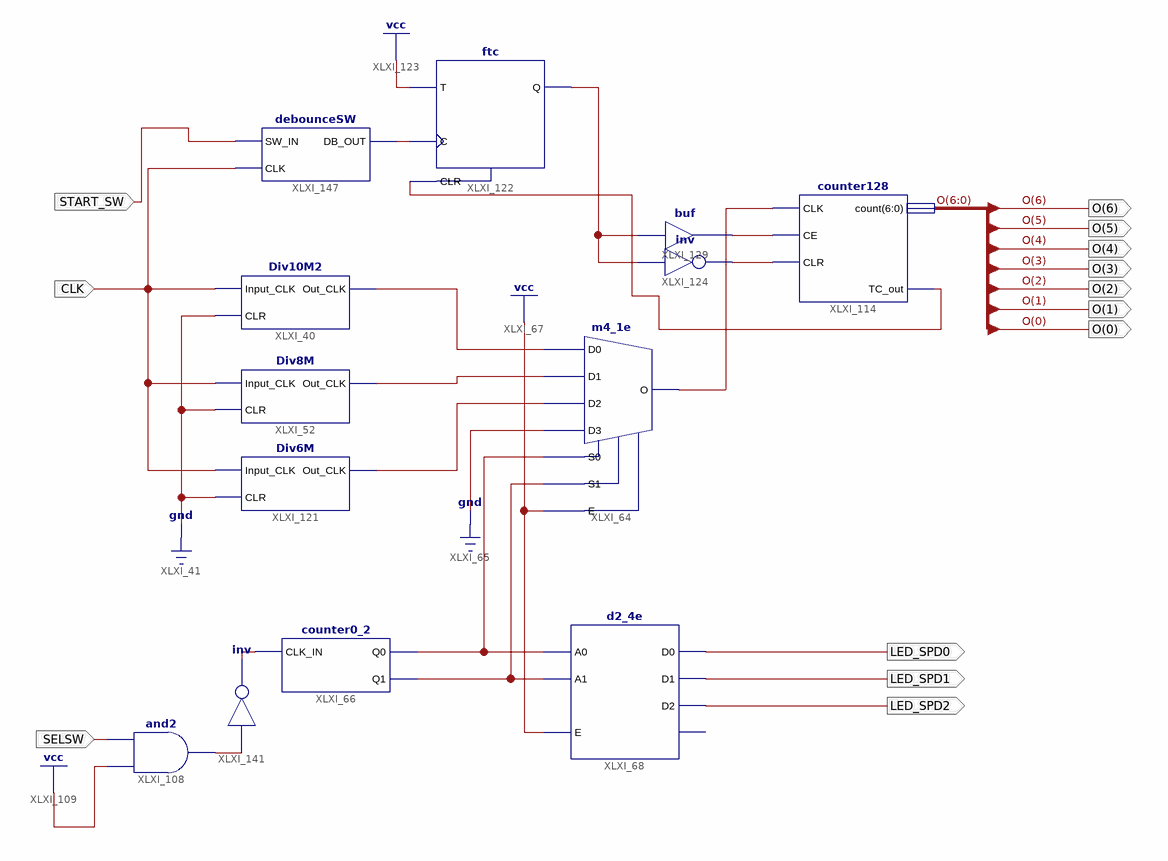
[diagram p0: schematic sheet 1]
// Xilinx ISE schematic project.sch (spartan6) as structural Verilog: 13 symbols, 13 ports
module project (
  input  CLK,
  input  SELSW,
  input  START_SW,
  output LED_SPD0,
  output LED_SPD1,
  output LED_SPD2,
  output [6:0] O
);

  wire XLXN_125, XLXN_126, XLXN_127, XLXN_129, XLXN_130, XLXN_184, XLXN_185, XLXN_188, XLXN_214, XLXN_215,
       XLXN_217, XLXN_235, XLXN_251;

  Div10M2 XLXI_40 (.Input_CLK(CLK), .CLR(1'b0), .Out_CLK(XLXN_125));
  m4_1e XLXI_64 (
    .D0(XLXN_125), .D1(XLXN_126), .D2(XLXN_127), .D3(1'b0), .E(1'b1), .S0(XLXN_129), .S1(XLXN_130),
    .O(XLXN_185));
  counter0_2 XLXI_66 (.CLK_IN(XLXN_235), .Q0(XLXN_129), .Q1(XLXN_130));
  d2_4e XLXI_68 (.A0(XLXN_129), .A1(XLXN_130), .E(1'b1), .D0(LED_SPD0), .D1(LED_SPD1), .D2(LED_SPD2));  // open: D3
  counter128 XLXI_114 (.CLR(XLXN_184), .CLK(XLXN_185), .CE(XLXN_214), .count(O), .TC_out(XLXN_217));
  Div8M XLXI_52 (.Input_CLK(CLK), .CLR(1'b0), .Out_CLK(XLXN_126));
  Div6M XLXI_121 (.Input_CLK(CLK), .CLR(1'b0), .Out_CLK(XLXN_127));
  not XLXI_124 (XLXN_184, XLXN_215);
  ftc XLXI_122 (.C(XLXN_251), .CLR(XLXN_217), .T(1'b1), .Q(XLXN_215));
  buf XLXI_129 (XLXN_214, XLXN_215);
  not XLXI_141 (XLXN_235, XLXN_188);
  and XLXI_108 (XLXN_188, 1'b1, SELSW);
  debounceSW XLXI_147 (.SW_IN(START_SW), .CLK(CLK), .DB_OUT(XLXN_251));
endmodule
